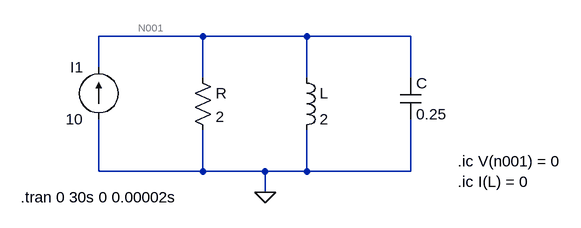
[diagram p0: schematic Q2(ii) - PartA.asc]
Q2(ii) - PartA.asc, the LTspice schematic file:
Version 4
SHEET 1 1360 680
WIRE 208 -208 48 -208
WIRE 368 -208 208 -208
WIRE 528 -208 368 -208
WIRE 48 -160 48 -208
WIRE 208 -144 208 -208
WIRE 368 -144 368 -208
WIRE 528 -144 528 -208
WIRE 48 0 48 -80
WIRE 208 0 208 -64
WIRE 208 0 48 0
WIRE 304 0 208 0
WIRE 368 0 368 -64
WIRE 368 0 304 0
WIRE 528 0 528 -80
WIRE 528 0 368 0
WIRE 304 32 304 0
FLAG 304 32 0
SYMBOL cap 512 -144 R0
SYMATTR InstName C
SYMATTR Value 0.25
SYMBOL current 48 -80 R180
WINDOW 0 24 80 Left 2
WINDOW 3 24 0 Left 2
SYMATTR InstName I1
SYMATTR Value 10
SYMBOL res 192 -160 R0
SYMATTR InstName R
SYMATTR Value 2
SYMBOL ind 352 -160 R0
SYMATTR InstName L
SYMATTR Value 2
TEXT -72 40 Left 2 !.tran 0 30s 0 0.00002s
TEXT 600 -16 Left 2 !.ic V(n001) = 0
TEXT 600 16 Left 2 !.ic I(L) = 0

The netlist it stands for:
* Q2(ii) - PartA.asc
C N001 0 0.25
I1 0 N001 10
R N001 0 2
L N001 0 2
.tran 0 30s 0 0.00002s
.ic V(n001) = 0
.ic I(L) = 0
.backanno
.end